# Altium project PCB_EMG_IMU.PrjPcb
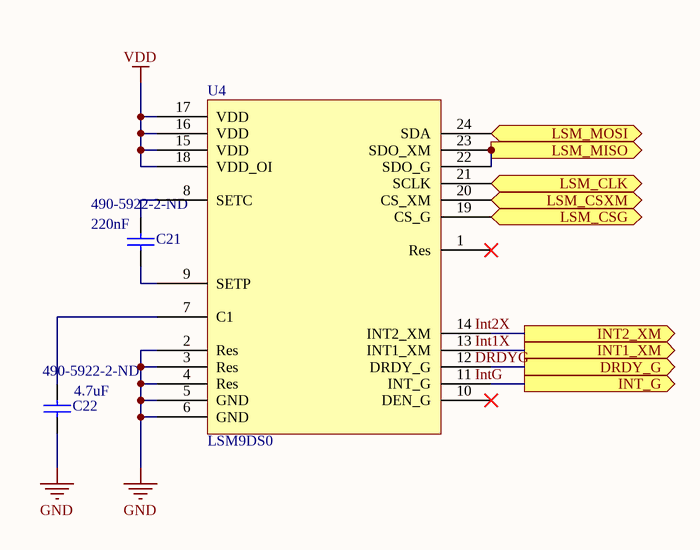
[diagram p0: LSM9DS0.SchDoc]
4 sheets, 49 parts. Net scope: flat (ports and power ports of the same name join across sheets).
Board files: PCB_EMG_IMU.PcbDoc, Moule_PCB_EMG_IMU.PcbDoc
Sheets:
  LSM9DS0.SchDoc
  MSP430F5528ZQFE.SchDoc
  nRF24L01.SchDoc
  PMU.SchDoc

## Sheet LSM9DS0.SchDoc
size A4

### Parts
C21  value 220nF  Supplier Part Number 1: 490-5922-2-ND  [0402]  (hidden comment: Cap Semi)
C22  value 4.7uF  Supplier Part Number 1: 490-5922-2-ND  [0402]  (hidden comment: Cap Semi)
U4  Component_1  [PCBComponent_1]  (value not drawn)

### Ports
DRDY_G (out), INT1_XM (out), INT2_XM (out), INT_G (out), LSM_CLK (in), LSM_CSG (in), LSM_CSXM (in), LSM_MISO (out), LSM_MOSI (in)

### Nets
GND: C22.1 U4.2(Res) U4.3(Res) U4.4(Res) U4.5(GND) U4.6(GND)
VDD: U4.15(VDD) U4.16(VDD) U4.17(VDD) U4.18(VDD_OI)
NetC21_1: C21.1 U4.9(SETP)
NetC21_2: C21.2 U4.8(SETC)
NetC22_2: C22.2 U4.7(C1)
NetU4_11: U4.11(INT_G) ; port INT_G
NetU4_12: U4.12(DRDY_G) ; port DRDY_G
NetU4_13: U4.13(INT1_XM) ; port INT1_XM
NetU4_14: U4.14(INT2_XM) ; port INT2_XM
NetU4_19: U4.19(CS_G) ; port LSM_CSG
NetU4_20: U4.20(CS_XM) ; port LSM_CSXM
NetU4_21: U4.21(SCLK) ; port LSM_CLK
NetU4_22: U4.22(SDO_G) U4.23(SDO_XM) ; port LSM_MISO
NetU4_24: U4.24(SDA) ; port LSM_MOSI

Not connected (* = marked no-connect by the designer): U4 1(Res)* 10(DEN_G)*

### Notes on the sheet
- Labels drawn without touching a wire or pin: DRDYG, Int1X, Int2X, IntG
- (in symbol Component_1) LSM9DS0

### Library data of the parts
C21 C22 = Cap Semi: Capacitor (Semiconductor SIM Model); Published: 8-Jun-2000; LatestRevisionDate: 29-May-2009; LatestRevisionNote: IPC-7351 Footprint Added.; PackageReference: C1206; Publisher: Altium Limited; PackageDescription: Chip Capacitor; Supplier 1: Digi-Key

## Sheet MSP430F5528ZQFE.SchDoc
size A4
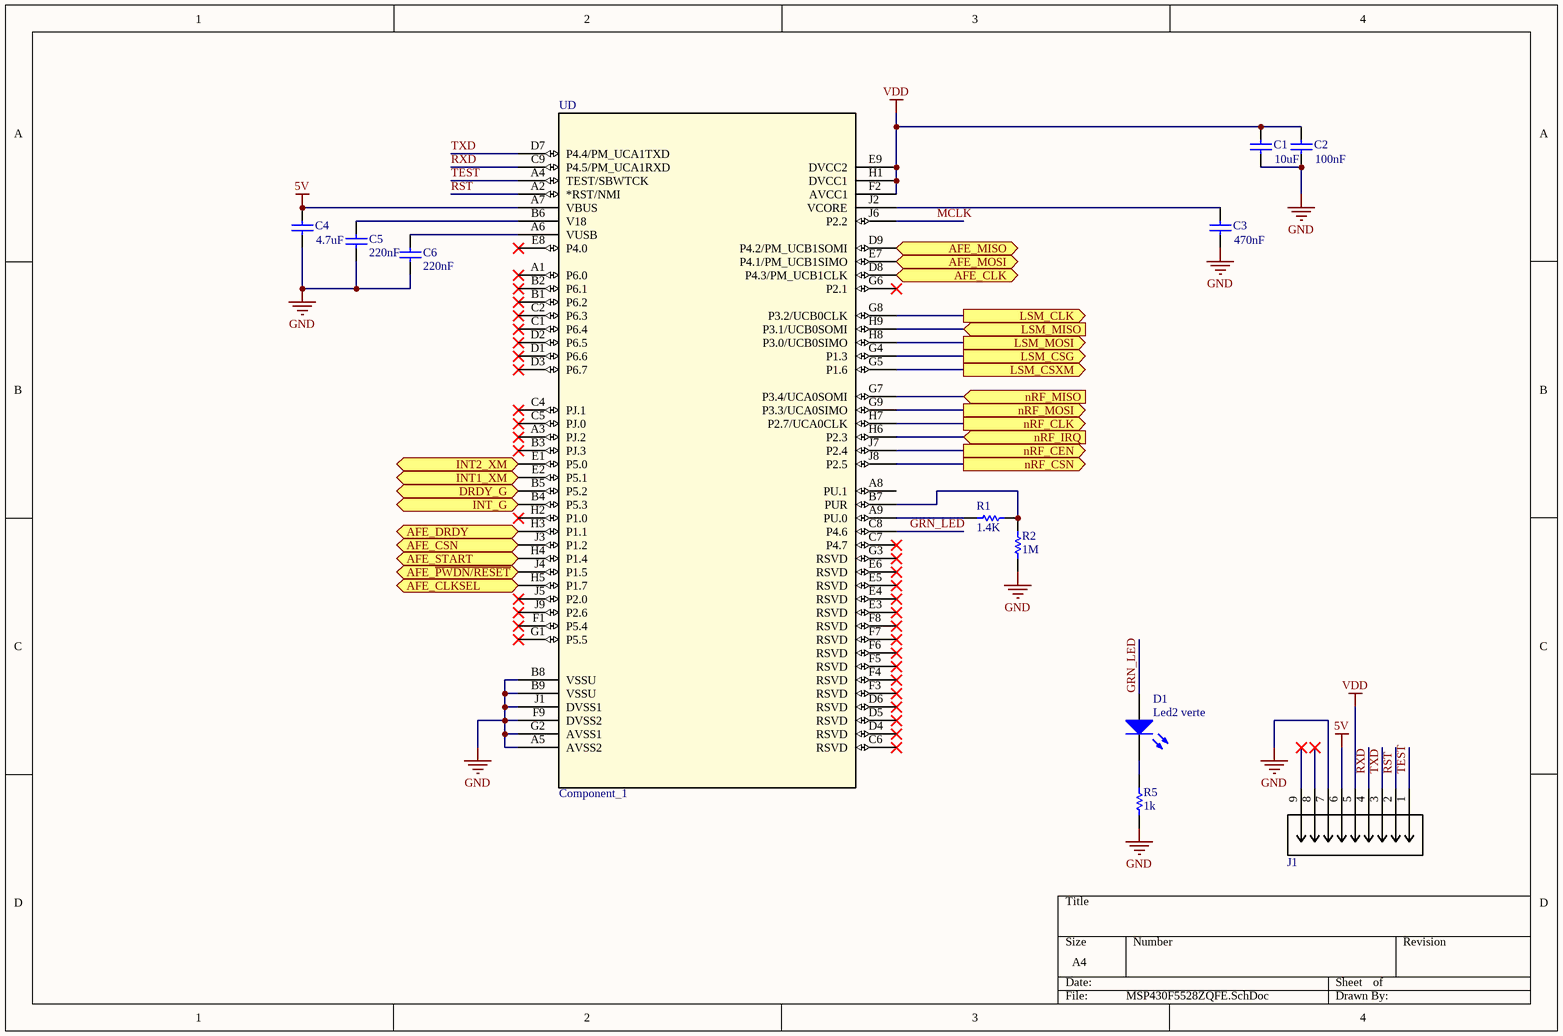
[diagram p1: MSP430F5528ZQFE.SchDoc]

### Parts
C1  value 10uF  [0402]  (hidden comment: Cap Semi)
C2  value 100nF  [0402]  (hidden comment: Cap Semi)
C3  value 470nF  [0402]  (hidden comment: Cap Semi)
C4  value 4.7uF  [0402]  (hidden comment: Cap Semi)
C5  value 220nF  [0402]  (hidden comment: Cap Semi)
C6  value 220nF  [0402]  (hidden comment: Cap Semi)
D1  Led2 verte  [0805 (2012 metric)]
J1  FH12-7S-1SH(55)  [CON7_1X7_DRBF_HS]  (value not drawn)
R1  value 1.4K  [0402]
R2  value 1M  [0402]
R5  value 1k  [0402]
UD  Component_1  [MSP430F5528ZQFE]

### Ports
AFE_CLK (out), AFE_CLKSEL (out), AFE_CSN (out), AFE_DRDY (in), AFE_MISO (in), AFE_MOSI (out), AFE_START (out), AFE_~{PWDN/RESET} (out), DRDY_G (in), INT1_XM (in), INT2_XM (in), INT_G (in), LSM_CLK (out), LSM_CSG (out), LSM_CSXM (out), LSM_MISO (in), LSM_MOSI (out), nRF_CEN (out), nRF_CLK (out), nRF_CSN (out), nRF_IRQ (in), nRF_MISO (in), nRF_MOSI (out)

### Nets
5V: C4.1 J1.6 UD.A7(VBUS)
GND: C1.2 C2.2 C3.2 C4.2 C5.1 C6.1 J1.7 R2.2 R5.2 UD.A5(AVSS2) UD.B8(VSSU) UD.B9(VSSU) UD.F9(DVSS2) UD.G2(AVSS1) UD.J1(DVSS1)
VDD: C1.1 C2.1 J1.5 UD.E9(DVCC2) UD.F2(AVCC1) UD.H1(DVCC1)
GRN_LED: D1.1(A) UD.C8(P4.6)
MCLK: UD.J6(P2.2)
RST: J1.2 UD.A2(*RST/NMI)
RXD: J1.4 UD.C9(P4.5/PM_UCA1RXD)
TEST: J1.1 UD.A4(TEST/SBWTCK)
TXD: J1.3 UD.D7(P4.4/PM_UCA1TXD)
NetC3_1: C3.1 UD.J2(VCORE)
NetC5_2: C5.2 UD.B6(V18)
NetC6_2: C6.2 UD.A6(VUSB)
NetD1_2: D1.2(K) R5.1
NetR1_1: R1.1 R2.1 UD.B7(PUR)
NetR1_2: R1.2 UD.A9(PU.0)
NetU2_1: UD.J7(P2.4) ; port nRF_CEN
NetU2_2: UD.J8(P2.5) ; port nRF_CSN
NetU2_3: UD.H7(P2.7/UCA0CLK) ; port nRF_CLK
NetU2_4: UD.G9(P3.3/UCA0SIMO) ; port nRF_MOSI
NetU2_5: UD.G7(P3.4/UCA0SOMI) ; port nRF_MISO
NetU2_6: UD.H6(P2.3) ; port nRF_IRQ
NetU4_11: UD.B4(P5.3) ; port INT_G
NetU4_12: UD.B5(P5.2) ; port DRDY_G
NetU4_13: UD.E2(P5.1) ; port INT1_XM
NetU4_14: UD.E1(P5.0) ; port INT2_XM
NetU4_19: UD.G4(P1.3) ; port LSM_CSG
NetU4_20: UD.G5(P1.6) ; port LSM_CSXM
NetU4_21: UD.G8(P3.2/UCB0CLK) ; port LSM_CLK
NetU4_22: UD.H9(P3.1/UCB0SOMI) ; port LSM_MISO
NetU4_24: UD.H8(P3.0/UCB0SIMO) ; port LSM_MOSI
NetUD_D8: UD.D8(P4.3/PM_UCB1CLK) ; port AFE_CLK
NetUD_D9: UD.D9(P4.2/PM_UCB1SOMI) ; port AFE_MISO
NetUD_E7: UD.E7(P4.1/PM_UCB1SIMO) ; port AFE_MOSI
NetUD_H3: UD.H3(P1.1) ; port AFE_DRDY
NetUD_H4: UD.H4(P1.4) ; port AFE_START
NetUD_H5: UD.H5(P1.7) ; port AFE_CLKSEL
NetUD_J3: UD.J3(P1.2) ; port AFE_CSN
NetUD_J4: UD.J4(P1.5) ; port AFE_~{PWDN/RESET}

Not connected (* = marked no-connect by the designer): J1 8* 9*; UD A1(P6.0)* A3(PJ.2)* A8(PU.1) B1(P6.2)* B2(P6.1)* B3(PJ.3)* C1(P6.4)* C2(P6.3)* C4(PJ.1)* C5(PJ.0)* C6(RSVD)* C7(P4.7)* D1(P6.6)* D2(P6.5)* D3(P6.7)* D4(RSVD)* D5(RSVD)* D6(RSVD)* E3(RSVD)* E4(RSVD)* E5(RSVD)* E6(RSVD)* E8(P4.0)* F1(P5.4)* F3(RSVD)* F4(RSVD)* F5(RSVD)* F6(RSVD)* F7(RSVD)* F8(RSVD)* G1(P5.5)* G3(RSVD)* G6(P2.1)* H2(P1.0)* J5(P2.0)* J9(P2.6)*

### Library data of the parts
C1-C6 = Cap Semi: Capacitor (Semiconductor SIM Model); Published: 8-Jun-2000; LatestRevisionDate: 29-May-2009; LatestRevisionNote: IPC-7351 Footprint Added.; PackageReference: C1206; Publisher: Altium Limited; PackageDescription: Chip Capacitor; Supplier 1: Digi-Key
  C1 C2: Supplier Part Number 1: 490-10692-2-ND
  C3: Supplier Part Number 1: 1276-1734-2-ND
  C4: Supplier Part Number 1: 490-5915-2-ND
  C5 C6: Supplier Part Number 1: 490-3884-2-ND
D1 = LED3: LED 2X1.2MM 570NM GN WTR CLR SMD; Supplier 1: Digi-Key; Supplier Part Number 1: 754-1651-1-ND
J1 = FH12-7S-1SH(55): Imported; Voltage_Rating: 50V; Current_Rating: 0.500A; Operating_Temperature: -40Â°C ~ 85Â°C; Contact_Finish: Gold; Cable_End_Type: Straight; Vendor: Hirose; Pitch: 0.039" (1.00mm); Mounting_Type: Surface Mount, Right Angle; Connector_Type: Bottom Contacts; Number_of_Positions: 7; Locking_Feature: Flip Lock; FFC,_FCB_Thickness: 0.30mm; Height_Above_Board: 0.079" (2.00mm); Copyright: Copyright (C) 2015 Accelerated Designs. All rights reserved; Housing_Material: Polyamide (PA), Nylon; Contact_Finish_Thickness: -; Manufacturer_Part_Number: FH12-7S-1SH(55); DigiKeyPartNumber: HFB107TR-ND; Quantity_Available: 10000; Category: Connectors; DataSheet: http://www.hirose.co.jp/cataloge_hp/e58605370.pdf; Features: Zero Insertion Force (ZIF); Packaging: Tape &amp; Reel (TR); Series: FH12; Termination: Solder; RefDes: RefDes; Type: Type; Value: Value
R1 R2 R5 = Res Semi: Semiconductor Resistor; Published: 8-Jun-2000; LatestRevisionDate: 17-Jul-2002; LatestRevisionNote: Re-released for DXP Platform.; PackageReference: AXIAL-0.5; Publisher: Altium Limited; PackageDescription: Axial Device, Thru-Hole; 2 Leads; 0.5 in Pin Spacing; Supplier 1: Digi-Key
  R1: Supplier Part Number 1: RHM1.4KBHTR-ND
  R2: Supplier Part Number 1: RHM1.00MCDTR-ND
  R5: Supplier Part Number 1: RHM100CDTR-ND

## Sheet nRF24L01.SchDoc
size A4
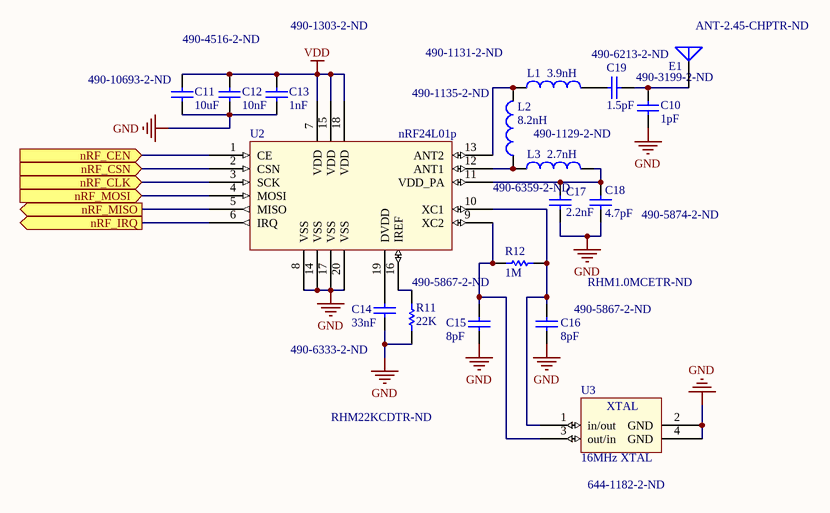
[diagram p2: nRF24L01.SchDoc]

### Parts
C10  value 1pF  Supplier Part Number 1: 490-3199-2-ND  [0402]
C11  value 10uF  Supplier Part Number 1: 490-10693-2-ND  [0402]
C12  value 10nF  Supplier Part Number 1: 490-4516-2-ND  [0402]
C13  value 1nF  Supplier Part Number 1: 490-1303-2-ND  [0402]
C14  value 33nF  Supplier Part Number 1: 490-6333-2-ND  [0402]
C15  value 8pF  Supplier Part Number 1: 490-5867-2-ND  [0402]
C16  value 8pF  Supplier Part Number 1: 490-5867-2-ND  [0402]
C17  value 2.2nF  Supplier Part Number 1: 490-6359-2-ND  [0402]
C18  value 4.7pF  Supplier Part Number 1: 490-5874-2-ND  [0402]
C19  value 1.5pF  Supplier Part Number 1: 490-6213-2-ND  [0402]
E1  Supplier Part Number 1: ANT-2.45-CHPTR-ND  [ANT-2.45-CHP-B]
L1  value 3.9nH  Supplier Part Number 1: 490-1131-2-ND  [0402]
L2  value 8.2nH  Supplier Part Number 1: 490-1135-2-ND  [0402]
L3  value 2.7nH  Supplier Part Number 1: 490-1129-2-ND  [0402]
R11  value 22K  Supplier Part Number 1: RHM22KCDTR-ND  [0402]
R12  value 1M  Supplier Part Number 1: RHM1.0MCETR-ND  [0402]
U2  nRF24L01p  [Component_nRF]
U3  16MHz XTAL  Supplier Part Number 1: 644-1182-2-ND  [8Y-16.000MAAV-T]

### Ports
nRF_CEN (in), nRF_CLK (in), nRF_CSN (in), nRF_IRQ (out), nRF_MISO (out), nRF_MOSI (in)

### Nets
GND: C10.2 C11.1 C12.1 C13.1 C14.1 C15.1 C16.1 C17.1 C18.1 R11.1 U2.8(VSS) U2.14(VSS) U2.17(VSS) U2.20(VSS) U3.2(GND) U3.4(GND)
VDD: C11.2 C12.2 C13.2 U2.7(VDD) U2.15(VDD) U2.18(VDD)
NetC10_1: C10.1 C19.1 E1.1(A)
NetC14_2: C14.2 U2.19(DVDD)
NetC15_2: C15.2 R12.2 U2.9(XC2) U3.3(out/in)
NetC16_2: C16.2 R12.1 U2.10(XC1) U3.1(in/out)
NetC17_2: C17.2 C18.2 L3.2 U2.11(VDD_PA)
NetC19_2: C19.2 L1.2
NetL1_1: L1.1 L2.2 U2.13(ANT2)
NetL2_1: L2.1 L3.1 U2.12(ANT1)
NetR11_2: R11.2 U2.16(IREF)
NetU2_1: U2.1(CE) ; port nRF_CEN
NetU2_2: U2.2(CSN) ; port nRF_CSN
NetU2_3: U2.3(SCK) ; port nRF_CLK
NetU2_4: U2.4(MOSI) ; port nRF_MOSI
NetU2_5: U2.5(MISO) ; port nRF_MISO
NetU2_6: U2.6(IRQ) ; port nRF_IRQ

### Notes on the sheet
- (in symbol 8Y-16.000MAAV-T) XTAL

### Library data of the parts
C10-C19 = Cap Semi: Capacitor (Semiconductor SIM Model); Published: 8-Jun-2000; LatestRevisionDate: 29-May-2009; LatestRevisionNote: IPC-7351 Footprint Added.; PackageReference: C1206; Publisher: Altium Limited; PackageDescription: Chip Capacitor; Supplier 1: Digi-Key
E1 = Antenna: Generic Antenna; Published: 24-Mar-1999; LatestRevisionDate: 17-Jul-2002; LatestRevisionNote: Re-released for DXP Platform.; PackageReference: PIN1; Publisher: Altium Limited; Supplier 1: Digi-Key
L1-L3 = Inductor: Code_IEC: 1005; Published: 8-Jun-2000; LatestRevisionDate: 29-May-2009; LatestRevisionNote: IPC-7351 Footprint Added.; PackageReference: 0402-A; Publisher: Altium Limited; PackageDescription: Chip Inductor; Code_JEITA: 0402; Supplier 1: Digi-Key
R11 R12 = Res Semi: Semiconductor Resistor; Published: 8-Jun-2000; LatestRevisionDate: 17-Jul-2002; LatestRevisionNote: Re-released for DXP Platform.; PackageReference: AXIAL-0.5; Publisher: Altium Limited; PackageDescription: Axial Device, Thru-Hole; 2 Leads; 0.5 in Pin Spacing; Supplier 1: Digi-Key
U2 = Component_nRF
U3 = 8Y-16.000MAAV-T: SMD 16 MHz XTAL; Supplier 1: Digi-Key

## Sheet PMU.SchDoc
size A4
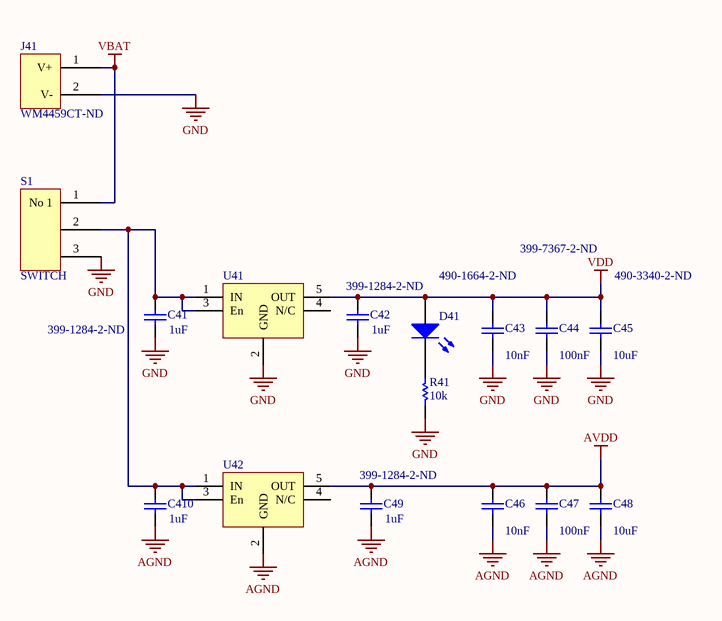
[diagram p3: PMU.SchDoc]

### Parts
C41  value 1uF  Supplier Part Number 1: 399-1284-2-ND  [0402]  (hidden comment: Cap Semi)
C42  value 1uF  Supplier Part Number 1: 399-1284-2-ND  [0402]  (hidden comment: Cap Semi)
C43  value 10nF  Supplier Part Number 1: 490-1664-2-ND  [0402]  (hidden comment: Cap Semi)
C44  value 100nF  Supplier Part Number 1: 399-7367-2-ND  [0402]  (hidden comment: Cap Semi)
C45  value 10uF  Supplier Part Number 1: 490-3340-2-ND  [0402]  (hidden comment: Cap Semi)
C46  value 10nF  [0402]  (hidden comment: Cap Semi)
C47  value 100nF  [0402]  (hidden comment: Cap Semi)
C48  value 10uF  [0402]  (hidden comment: Cap Semi)
C49  value 1uF  Supplier Part Number 1: 399-1284-2-ND  [0402]  (hidden comment: Cap Semi)
C410  value 1uF  [0402]  (hidden comment: Cap Semi)
D41  Alim led verte  [0805 (2012 metric)]  (value not drawn)
J41  WM4459CT-ND  [WM4459CT-ND]
R41  value 10k  [0402]
S1  SWITCH  [CUS-12B]
U41  Reg 3.3V  [TSOP-5ll]  (value not drawn)
U42  Reg 3.3V  [TSOP-5ll]  (value not drawn)

### Nets
AGND: C46.1 C47.1 C48.1 C49.1 C410.1 U42.2(GND)
AVDD: C46.2 C47.2 C48.2 C49.2 U42.5(OUT)
GND: C41.1 C42.1 C43.1 C44.1 C45.1 J41.2(V-) R41.2 S1.3 U41.2(GND)
VBAT: J41.1(V+) S1.1(No_1)
VDD: C42.2 C43.2 C44.2 C45.2 D41.1(A) U41.5(OUT)
NetC41_2: C41.2 C410.2 S1.2 U41.1(IN) U41.3(En) U42.1(IN) U42.3(En)
NetD41_2: D41.2(K) R41.1

Not connected (* = marked no-connect by the designer): U41 4(N/C); U42 4(N/C)

### Library data of the parts
C41-C49 C410 = Cap Semi: Capacitor (Semiconductor SIM Model); Published: 8-Jun-2000; LatestRevisionDate: 29-May-2009; LatestRevisionNote: IPC-7351 Footprint Added.; PackageReference: C1206; Publisher: Altium Limited; PackageDescription: Chip Capacitor; Supplier 1: Digi-Key
  C46: Supplier Part Number 1: 490-1664-2-ND
  C47: Supplier Part Number 1: 399-7367-2-ND
  C48: Supplier Part Number 1: 490-3340-2-ND
  C410: Supplier Part Number 1: 399-1284-2-ND
D41 = LED3: LED 2X1.2MM 570NM GN WTR CLR SMD; Supplier 1: Digi-Key; Supplier Part Number 1: 754-1127-1-ND
R41 = Res Semi: Semiconductor Resistor; Published: 8-Jun-2000; LatestRevisionDate: 17-Jul-2002; LatestRevisionNote: Re-released for DXP Platform.; PackageReference: AXIAL-0.5; Publisher: Altium Limited; PackageDescription: Axial Device, Thru-Hole; 2 Leads; 0.5 in Pin Spacing
S1 = Component_1
U41 U42 = NCP603SN330T1G: IC REG LDO 3.3V 0.3A 5TSOP; Supplier 1: Digi-Key; Supplier Part Number 1: NCP603SN330T1GOSCT-ND

## Nets that join several sheets
GND: LSM9DS0 (6 pins), MSP430F5528ZQFE (15 pins), nRF24L01 (16 pins), PMU (9 pins)
VDD: LSM9DS0 (U4.15 U4.16 U4.17 U4.18), MSP430F5528ZQFE (6 pins), nRF24L01 (6 pins), PMU (6 pins)
NetU2_1: MSP430F5528ZQFE (UD.J7), nRF24L01 (U2.1)
NetU2_2: MSP430F5528ZQFE (UD.J8), nRF24L01 (U2.2)
NetU2_3: MSP430F5528ZQFE (UD.H7), nRF24L01 (U2.3)
NetU2_4: MSP430F5528ZQFE (UD.G9), nRF24L01 (U2.4)
NetU2_5: MSP430F5528ZQFE (UD.G7), nRF24L01 (U2.5)
NetU2_6: MSP430F5528ZQFE (UD.H6), nRF24L01 (U2.6)
NetU4_11: LSM9DS0 (U4.11), MSP430F5528ZQFE (UD.B4)
NetU4_12: LSM9DS0 (U4.12), MSP430F5528ZQFE (UD.B5)
NetU4_13: LSM9DS0 (U4.13), MSP430F5528ZQFE (UD.E2)
NetU4_14: LSM9DS0 (U4.14), MSP430F5528ZQFE (UD.E1)
NetU4_19: LSM9DS0 (U4.19), MSP430F5528ZQFE (UD.G4)
NetU4_20: LSM9DS0 (U4.20), MSP430F5528ZQFE (UD.G5)
NetU4_21: LSM9DS0 (U4.21), MSP430F5528ZQFE (UD.G8)
NetU4_22: LSM9DS0 (U4.22 U4.23), MSP430F5528ZQFE (UD.H9)
NetU4_24: LSM9DS0 (U4.24), MSP430F5528ZQFE (UD.H8)